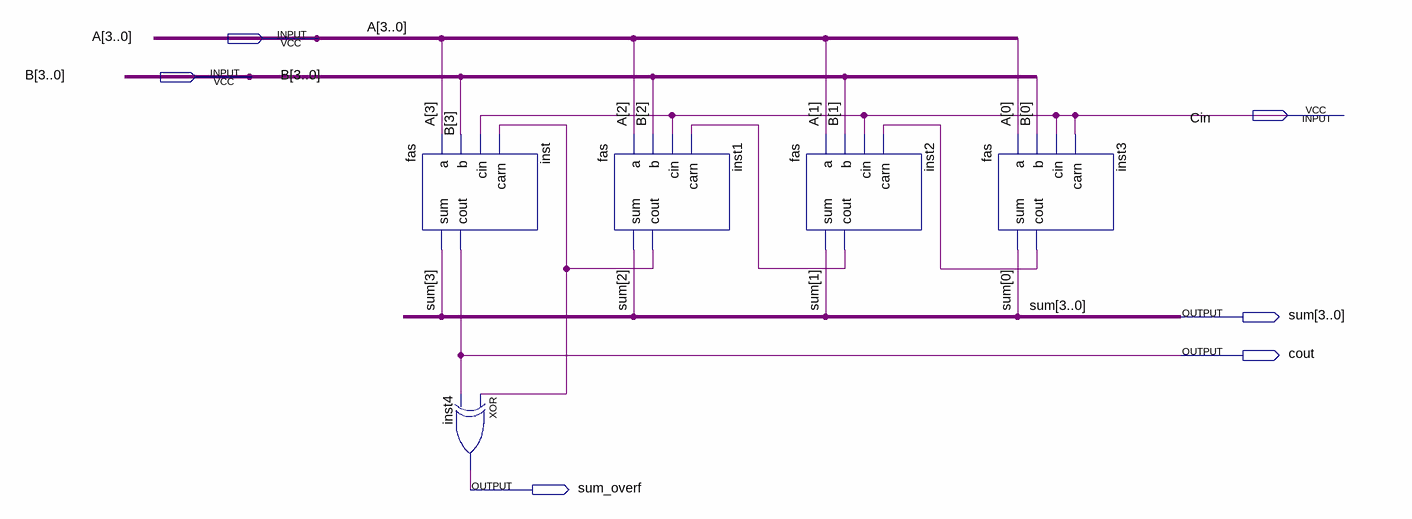
[diagram p0: schematic sheet]
// Quartus schematic four_as.bdf as structural Verilog: 5 symbols, 6 pins
module four_as (
  input  [3:0] A,
  input  [3:0] B,
  input  Cin,
  output [3:0] sum,
  output cout,
  output sum_overf
);

  wire inst1_cout, inst2_cout, inst3_cout;

  fas inst (.a(A[3]), .b(B[3]), .cin(Cin), .carn(inst1_cout), .sum(sum[3]), .cout(cout));
  xor inst4 (sum_overf, inst1_cout, cout);
  fas inst1 (.a(A[2]), .b(B[2]), .cin(Cin), .carn(inst2_cout), .sum(sum[2]), .cout(inst1_cout));
  fas inst2 (.a(A[1]), .b(B[1]), .cin(Cin), .carn(inst3_cout), .sum(sum[1]), .cout(inst2_cout));
  fas inst3 (.a(A[0]), .b(B[0]), .cin(Cin), .carn(Cin), .sum(sum[0]), .cout(inst3_cout));
endmodule
